# EAGLE design DC_POWER_SUPPLY (EAGLE 9.0.0)
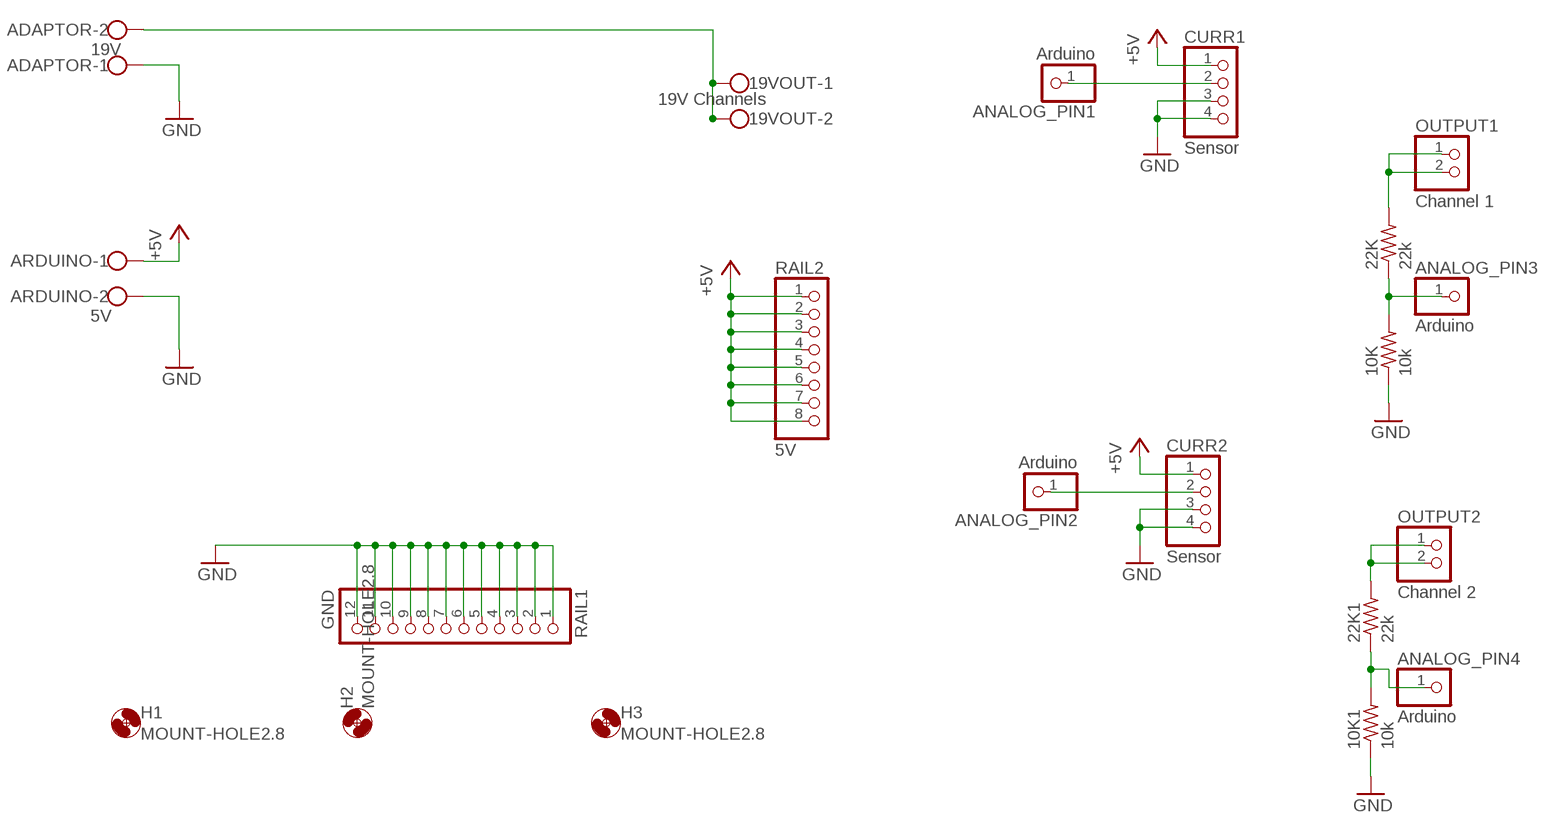
[diagram p0: schematic, sheet 1]

## Parts
10K  10k  R-US_0204/7  [0204/7]
10K1  10k  R-US_0204/7  [0204/7]
19VOUT  19V Channels  W237-102  [W237-102]
22K  22k  R-US_0207/7  [0207/7]
22K1  22k  R-US_0204/7  [0204/7]
ADAPTOR  19V  W237-102  [W237-102]
ANALOG_PIN1  Arduino  PINHD-1X1  [1X01]
ANALOG_PIN2  Arduino  PINHD-1X1  [1X01]
ANALOG_PIN3  Arduino  PINHD-1X1  [1X01]
ANALOG_PIN4  Arduino  PINHD-1X1  [1X01]
ARDUINO  5V  W237-102  [W237-102]
CURR1  Sensor  PINHD-1X4  [1X04]
CURR2  Sensor  PINHD-1X4  [1X04]
H1  MOUNT-HOLE2.8  [2,8]
H2  MOUNT-HOLE2.8  [2,8]
H3  MOUNT-HOLE2.8  [2,8]
OUTPUT1  Channel 1  PINHD-1X2  [1X02]
OUTPUT2  Channel 2  PINHD-1X2  [1X02]
RAIL1  GND  PINHD-1X12  [1X12]
RAIL2  5V  PINHD-1X8  [1X08]

## Nets
+5V: ARDUINO.1 CURR1.1 CURR2.1 RAIL2.1 RAIL2.2 RAIL2.3 RAIL2.4 RAIL2.5 RAIL2.6 RAIL2.7 RAIL2.8
GND: 10K1.1 10K.1 ADAPTOR.1 ARDUINO.2 CURR1.3 CURR1.4 CURR2.3 CURR2.4 RAIL1.1 RAIL1.2 RAIL1.3 RAIL1.4 RAIL1.5 RAIL1.6 RAIL1.7 RAIL1.8 RAIL1.9 RAIL1.10 RAIL1.11 RAIL1.12
N$1: 10K1.2 22K1.1 ANALOG_PIN4.1
N$2: ANALOG_PIN1.1 CURR1.2
N$3: ANALOG_PIN2.1 CURR2.2
N$4: 22K.2 OUTPUT1.1 OUTPUT1.2
N$5: 10K.2 22K.1 ANALOG_PIN3.1
N$6: 22K1.2 OUTPUT2.1 OUTPUT2.2
N$7: 19VOUT.1 19VOUT.2 ADAPTOR.2

## Library data of the parts
10K 10K1 22K 22K1 = resistor:R-US_: RESISTOR, American symbol
19VOUT ADAPTOR ARDUINO = con-wago-500:W237-102: WAGO SCREW CLAMP; MPN: 237-102; OC_FARNELL: unknown; OC_NEWARK: 70K9898
ANALOG_PIN1-ANALOG_PIN4 = pinhead:PINHD-1X1: PIN HEADER
CURR1 CURR2 = pinhead:PINHD-1X4: PIN HEADER
H1-H3 = holes:MOUNT-HOLE: MOUNTING HOLE with drill center marker
OUTPUT1 OUTPUT2 = pinhead:PINHD-1X2: PIN HEADER
RAIL1 = pinhead:PINHD-1X12: PIN HEADER
RAIL2 = pinhead:PINHD-1X8: PIN HEADER

## Board
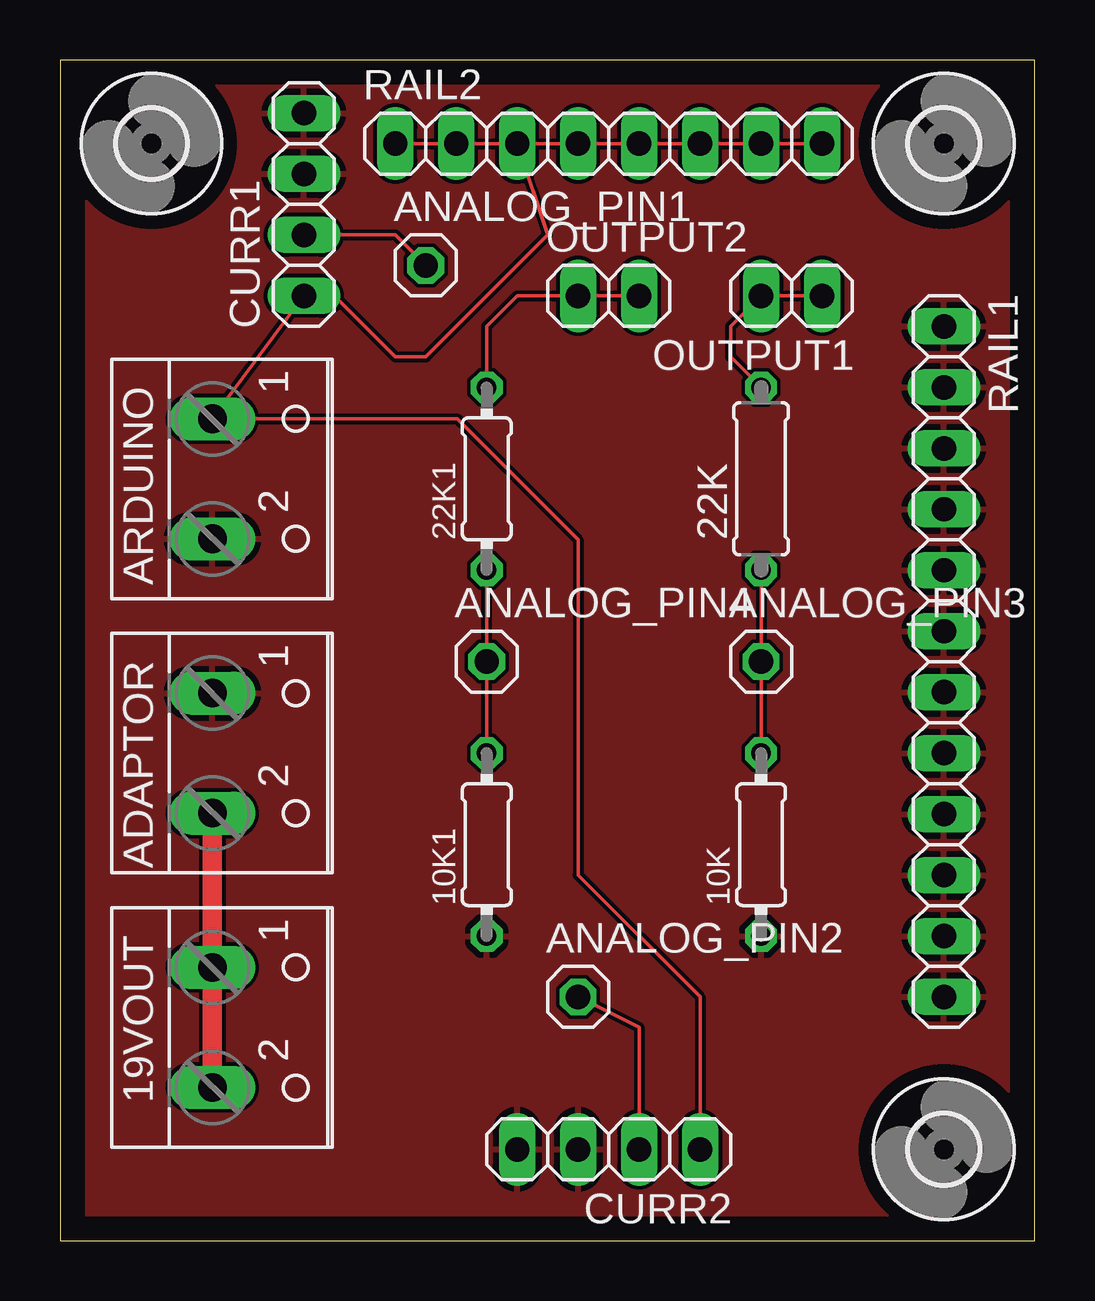
[diagram p1: board, top side]

Size 40.62 x 49.2 mm. Coordinates in mm from the lower left corner, seen from the top.
Outline: 0,0 40.62,0 40.62,49.2 0,49.2 0,0
Copper layers (1*16): Top 0.035mm / dielectric 1.5mm / Bottom 0.035mm
Design rules "default": minimum track width 6mil, minimum drill 0.35mm, track to track 6mil, track to pad 6mil, pad to pad 6mil, via to via 6mil, smd to smd 6mil, copper to edge 40mil, drill to drill 6mil, minimum pad ring 10mil, minimum via ring 8mil, stop-mask expansion 4mil, vias tented up to drill 0mil, thermal gap 10mil

### Footprints (pad centres in the part's own frame; a part is rotated, then mirrored left to right if it is on the bottom)
0204/7 = drill 0.813 octagon: 1 -3.81,0; 2 3.81,0
W237-102 = drill 1.194 long: 1 -2.5,-1.27; 2 2.5,-1.27
0207/7 = drill 0.813 octagon: 1 -3.81,0; 2 3.81,0
1X01 = drill 1.016 octagon: 1 0,0
1X04 = drill 1.016 long: 1 -3.81,0; 2 -1.27,0; 3 1.27,0; 4 3.81,0
2,8 = hole 2.8: 0,0
1X02 = drill 1.016 long: 1 -1.27,0; 2 1.27,0
1X12 = drill 1.016 long: 1 -13.97,0; 2 -11.43,0; 3 -8.89,0; 4 -6.35,0; 5 -3.81,0; 6 -1.27,0; 7 1.27,0; 8 3.81,0; 9 6.35,0; 10 8.89,0; 11 11.43,0; 12 13.97,0
1X08 = drill 1.016 long: 1 -8.89,0; 2 -6.35,0; 3 -3.81,0; 4 -1.27,0; 5 1.27,0; 6 3.81,0; 7 6.35,0; 8 8.89,0

### Placement (x,y rotation side)
10K  29.21,16.51 90 top
10K1  17.78,16.51 90 top
19VOUT  7.62,8.89 270 top
22K  29.21,31.75 90 top
22K1  17.78,31.75 90 top
ADAPTOR  7.62,20.32 270 top
ANALOG_PIN1  15.24,40.64 0 top
ANALOG_PIN2  21.59,10.16 0 top
ANALOG_PIN3  29.21,24.13 0 top
ANALOG_PIN4  17.78,24.13 0 top
ARDUINO  7.62,31.75 270 top
CURR1  10.16,43.18 90 top
CURR2  22.86,3.81 180 top
H1  3.81,45.72 0 top
H2  36.83,45.72 0 top
H3  36.83,3.81 0 top
OUTPUT1  30.48,39.37 180 top
OUTPUT2  22.86,39.37 0 top
RAIL1  36.83,24.13 270 top
RAIL2  22.86,45.72 0 top

### Tracks (layer width: path | path; a pad name or v marks a point on that pad's centre or on a via)
+5V
  Top 0.152: CURR2.1 26.67,10.16 21.59,15.24 21.59,29.21 16.55,34.25 ARDUINO.1 CURR1.1 11.43,39.37 13.97,36.83 15.24,36.83 20.32,41.91 RAIL2.3 | RAIL2.1 RAIL2.2 RAIL2.3 | RAIL2.3 RAIL2.4 RAIL2.5 RAIL2.6 RAIL2.7 RAIL2.8
GND
  pour Top: 0,-1.27 0,49.53 40.64,49.53 40.64,0
N$1
  Top 0.152: 10K1.2 ANALOG_PIN4.1 22K1.1
N$2
  Top 0.152: CURR1.2 13.97,41.91 ANALOG_PIN1.1
N$3
  Top 0.152: ANALOG_PIN2.1 24.13,8.89 CURR2.2
N$4
  Top 0.152: 22K.2 27.94,36.83 27.94,38.1 OUTPUT1.2 OUTPUT1.1
N$5
  Top 0.152: 22K.1 ANALOG_PIN3.1 10K.2
N$6
  Top 0.152: 22K1.2 17.78,38.1 19.05,39.37 OUTPUT2.1 OUTPUT2.2
N$7
  Top 0.813: ADAPTOR.2 19VOUT.1 19VOUT.2